# Altium project breakout_board.PrjPcb
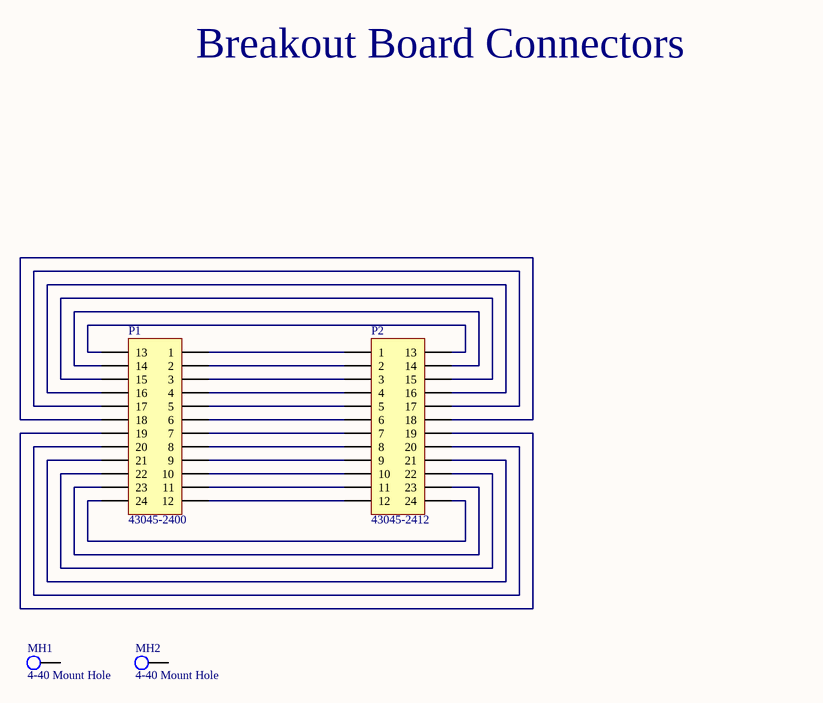
[diagram p0: connectors.SchDoc]
2 sheets, 4 parts. Net scope: global (net labels, ports and power ports of the same name join across sheets).
Board file: breakout_board.PcbDoc
Sheets:
  connectors.SchDoc
  breakout_board.SchDoc

## Sheet connectors.SchDoc: Connectors
size A4; CompanyName: Badgerloop Electrical; Engineer: Andrew Cook; Organization: Badgerloop Electrical; Address1: 133 Engineering Research Building; Address2: 1500 Engineering Drive; Address3: Madison, WI 53706; Address4: Badgerloop Electrical; DocumentNumber: 2; Revision: 1; SheetNumber: 2; SheetTotal: 1

### Parts
MH1  4-40 Mount Hole  [MH]
MH2  4-40 Mount Hole  [MH]
P1  43045-2400  [430452400]
P2  43045-2412  [0430452412]

### Nets
NetP1_1: P1.1 P2.1
NetP1_2: P1.2 P2.2
NetP1_3: P1.3 P2.3
NetP1_4: P1.4 P2.4
NetP1_5: P1.5 P2.5
NetP1_6: P1.6 P2.6
NetP1_7: P1.7 P2.7
NetP1_8: P1.8 P2.8
NetP1_9: P1.9 P2.9
NetP1_10: P1.10 P2.10
NetP1_11: P1.11 P2.11
NetP1_12: P1.12 P2.12
NetP1_13: P1.13 P2.13
NetP1_14: P1.14 P2.14
NetP1_15: P1.15 P2.15
NetP1_16: P1.16 P2.16
NetP1_17: P1.17 P2.17
NetP1_18: P1.18 P2.18
NetP1_19: P1.19 P2.19
NetP1_20: P1.20 P2.20
NetP1_21: P1.21 P2.21
NetP1_22: P1.22 P2.22
NetP1_23: P1.23 P2.23
NetP1_24: P1.24 P2.24

Not connected (* = marked no-connect by the designer): MH1 46; MH2 46

### Notes on the sheet
- Breakout Board Connectors
- Title
- Engineer:
- Date:
- Time:
- Revision:
- Sheet
- of
- File:

### Library data of the parts
P1 = 43045-2400: Molex MICRO-FIT 3.0 Series, Series Number 43045, 3mm Pitch 24 Way 2 Row Right Angle PCB Header, Solder Termination, 5A; Number of Contacts: 24; Contact Resistance: 10mR; Max Voltage Rating (DC): 250.25kV; Voltage Rating: 600V; Voltage Rating (AC): 250V; Gender: Male; Insulation Resistance: 1GR; Approvals: UL,CSA,TUV; Glow Wire Compliant: Compliant; Supplier 1: Digi-Key; Manufacturer: Molex; Manufacturer Part Number: 43045-2400; Stock 1: 970; Pricing 1: 1=6.20000, 10=5.95100, 100=4.95920, 576=4.21531, 1152=3.59542 (USD); RoHS: Yes; Mount: Through Hole; Contact Plating: Tin; Contact Material: Brass,Tin; Color: Black; Housing Color: Black; Housing Material: Thermoplastic; Min Operating Temperature: -40°C; Max Operating Temperature: 105°C; Number of Rows: 2; Termination: Solder; Packaging: Tray; Number of Positions: 24; Orientation: Right Angle; Max Current Rating: 5A; Current Rating: 5A; Package Quantity: 576; Number of Poles: 24; Number of Circuits: 24; Working Voltage: 250V; Operating Supply Voltage: 250V; Voltage Rating (DC): 250V; Length: 40.15mm; Height: 8.77mm; Pitch: 3mm; Row Spacing: 3mm; Depth: 12.2mm; Lead Pitch: 3mm; Radiation Hardening: No; Flammability Rating: UL94 V-0; REACH SVHC: Unknown; Halogen Free: Low Halogen; Lead Free: Lead Free; ComponentLink1URL: https://datasheet.ciiva.com/19461/800104-19461233.pdf?src-supplier=Jameco; ComponentLink1Description: https://datasheet.ciiva.com/19461/800104-19461233.pdf?src-supplier=Jameco; ComponentLink2URL: https://datasheet.ciiva.com/36179/144580430452400-pcb-headers-36179650.pdf?src-supplier=Onlinecomponents.com; ComponentLink2Description: https://datasheet.ciiva.com/36179/144580430452400-pcb-headers-36179650.pdf?src-supplier=Onlinecomponents.com; ComponentLink3URL: https://datasheet.ciiva.com/5156/0430452400-pcb-headers-5156852.pdf?src-supplier=Mouser; ComponentLink3Description: https://datasheet.ciiva.com/5156/0430452400-pcb-headers-5156852.pdf?src-supplier=Mouser; ComponentLink4URL: https://datasheet.ciiva.com/11748/0900766b80d6135b-11748645.pdf?src-supplier=RSComponents; ComponentLink4Description: https://datasheet.ciiva.com/11748/0900766b80d6135b-11748645.pdf?src-supplier=RSComponents; ComponentLink5URL: https://datasheet.ciiva.com/7839/1596512-7839674.pdf?src-supplier=Element14; ComponentLink5Description: https://datasheet.ciiva.com/7839/1596512-7839674.pdf?src-supplier=Element14; ComponentLink6URL: https://datasheet.ciiva.com/16657/0430452400-pcb-headers-16657916.pdf?src-supplier=Avnet+Europe; ComponentLink6Description: https://datasheet.ciiva.com/16657/0430452400-pcb-headers-16657916.pdf?src-supplier=Avnet+Europe; ComponentLink7URL: https://datasheet.ciiva.com/14155/04402310-14155214.pdf?src-supplier=Distrelec; ComponentLink7Description: https://datasheet.ciiva.com/14155/04402310-14155214.pdf?src-supplier=Distrelec; Supplier Part Number 1: WM4728-ND
P2 = 43045-2412: HEADER, VERTICAL, 24WAY; Series:Micro-Fit 3.0; Pitch Spacing:3mm; Contact Termination Type:Through Hole; No. of Contacts:24; No. of Rows:2; Connector Mounting:PCB; Gender:Plug; Contact Material:Brass; Contact Plating:Tin; ;RoHS Compliant: Yes; Manufacturer: Molex; Contact Resistance: 10mR; Number of Positions: 24; Connector Type: Plug,Socket; Current Rating: 5A; Voltage Rating (AC): 250V; Voltage Rating: 600V; Max Voltage Rating (DC): 250.25kV; Gender: Male; Insulation Resistance: 1GR; Pitch: 3mm; Approvals: UL,CSA,TUV; Supplier 1: Digi-Key; Stock 1: 772; Pricing 1: 1=4.89, 10=4.693, 100=3.9112, 576=3.32451, 1152=2.83562 (USD); Mount: Through Hole; Contact Plating: Tin; Contact Material: Brass,Tin; Color: Black; Housing Color: Black; Housing Material: Thermoplastic; Material: Polyester; Min Operating Temperature: -40°C; Max Operating Temperature: 105°C; Number of Rows: 2; Packaging: Tray; Termination: Solder; Number of Contacts: 24; Orientation: Vertical; Number of Poles: 24; Max Current Rating: 5A; Package Quantity: 576; Number of Circuits: 24; Working Voltage: 250V; Operating Supply Voltage: 250V; Voltage Rating (DC): 250V; Length: 40.15mm; Height: 9.91mm; Row Spacing: 3mm; Depth: 8.77mm; Lead Pitch: 3mm; Radiation Hardening: No; REACH SVHC: Unknown; Halogen Free: Low Halogen; Glow Wire Compliant: Compliant; Lead Free: Lead Free; Flammability Rating: UL94 V-0; ComponentLink1URL: http://www.farnell.com/datasheets/1786158.pdf?src-supplier=Element14; ComponentLink1Description: http://www.farnell.com/datasheets/1786158.pdf?src-supplier=Element14; ComponentLink2URL: https://www.alliedelec.com/m/d/28e7c516ce872cc01c31d58871c770af.pdf?src-supplier=Allied+Electronics; ComponentLink2Description: https://www.alliedelec.com/m/d/28e7c516ce872cc01c31d58871c770af.pdf?src-supplier=Allied+Electronics; ComponentLink3URL: http://www.jameco.com/Jameco/Products/ProdDS/883907.pdf?src-supplier=Jameco; ComponentLink3Description: http://www.jameco.com/Jameco/Products/ProdDS/883907.pdf?src-supplier=Jameco; ComponentLink4URL: http://www.mouser.com/ds/2/276/0430452412_PCB_HEADERS-168381.pdf?src-supplier=Mouser; ComponentLink4Description: http://www.mouser.com/ds/2/276/0430452412_PCB_HEADERS-168381.pdf?src-supplier=Mouser; ComponentLink5URL: http://www.molex.com/webdocs/datasheets/pdf/en-us/0430452412_PCB_HEADERS.pdf?src-supplier=Avnet; ComponentLink5Description: http://www.molex.com/webdocs/datasheets/pdf/en-us/0430452412_PCB_HEADERS.pdf?src-supplier=Avnet; ComponentLink6URL: http://uk.rs-online.com/webdocs/13c3/0900766b813c3b1e.pdf?src-supplier=RSComponents; ComponentLink6Description: http://uk.rs-online.com/webdocs/13c3/0900766b813c3b1e.pdf?src-supplier=RSComponents; ComponentLink7URL: http://www.molex.com/webdocs/datasheets/pdf/en-us/0430452412_PCB_HEADERS.pdf?src-supplier=Avnet+Europe; ComponentLink7Description: http://www.molex.com/webdocs/datasheets/pdf/en-us/0430452412_PCB_HEADERS.pdf?src-supplier=Avnet+Europe; Supplier Part Number 1: WM4716-ND

## Sheet breakout_board.SchDoc: Breakout Board
size A4; Engineer: Andrew Cook; Organization: Badgerloop; Address1: 133 Engineering Research; Address2: Building; Address3: Madison, WI 53715; DocumentNumber: 1; Revision: 1; SheetNumber: 1
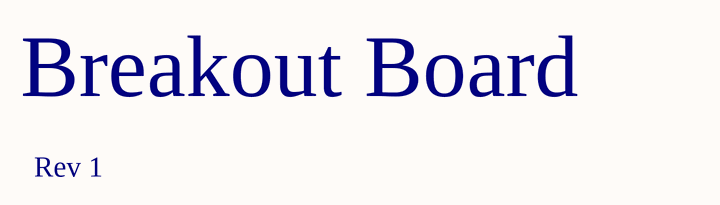
[diagram p1: breakout_board.SchDoc]

### Notes on the sheet
- Breakout Board
- Rev 1
- Title
- Size:
- Date:
- A4
- Number:
- Time:
- Revision:
- Sheet
- of
- File: